# EAGLE schematic GasSensor (EAGLE 7.3.0)
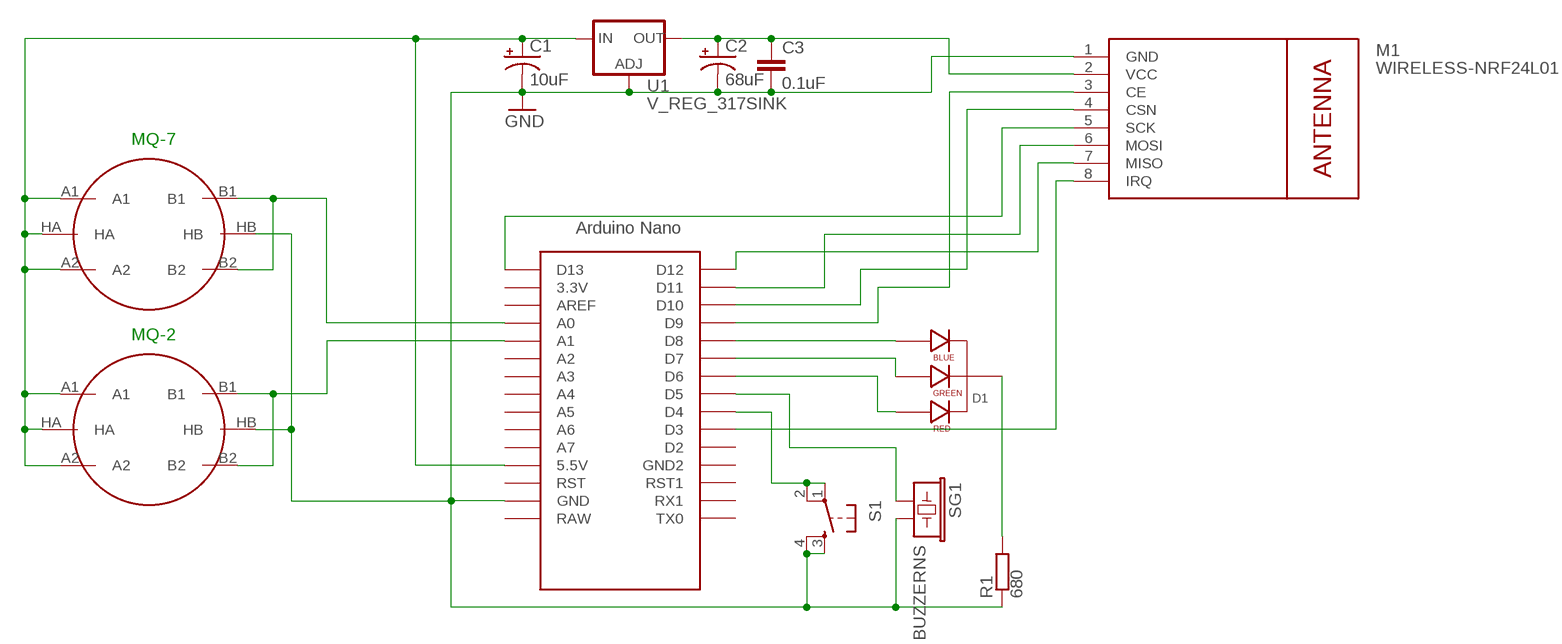
[diagram p0: schematic, sheet 1]

## Parts
C1  10uF  CAP_POL1206  [EIA3216]
C2  68uF  CAP_POL1206  [EIA3216]
C3  0.1uF  CAPEZ  [CAP-PTH-SMALLEZ]
D1  LED-RGB-CC-THRUCLEAR  [LED-RGB-THRU]
M1  WIRELESS-NRF24L01  [WIRELESS-NRF24L01]
R1  680  SMK  [SMK]
S1  TAC_SWITCHPTH  [TACTILE-PTH]
SG1  BUZZERNS  [BUZZER-12MM-NS]
U1  V_REG_317SINK  [TO220-ADJ]
U$1  NANO  [NANO]
U$2  CO2_SENSOR  METHANE_SENSOR  [MQ-3]
U$3  METHANE_SENSOR  [MQ-3]

## Nets
GND: C1.C(-) C2.C(-) C3.2 M1.1(GND) R1.2 S1.3 S1.4 SG1.- U1.ADJ U$1.GND U$2.HB U$3.HB
N$1: C1.A(+) U1.IN U$1.5V(5.5V) U$2.A1 U$2.A2 U$2.HA U$3.A1 U$3.A2 U$3.HA
N$2: D1.2(CATHODE) R1.1
N$3: U$1.A1 U$3.B1 U$3.B2
N$4: D1.4(BLUE_CATHODE) U$1.D8
N$5: C2.A(+) C3.1 M1.2(VCC) U1.OUT
N$6: M1.3(CE) U$1.D9
N$7: M1.4(CSN) U$1.D10
N$8: M1.7(MISO) U$1.D12
N$9: M1.6(MOSI) U$1.D11
N$10: M1.5(SCK) U$1.D13
N$11: D1.3(GREEN_CATHODE) U$1.D7
N$12: U$1.A0 U$2.B1 U$2.B2
N$13: M1.8(IRQ) U$1.D3
N$14: D1.1(RED_CATHODE) U$1.D6
N$15: SG1.+ U$1.D5
N$16: S1.1 S1.2 U$1.D4
Unconnected: U$1.3.3V U$1.A2 U$1.A3 U$1.A4 U$1.A5 U$1.A6 U$1.A7 U$1.AREF U$1.D2 U$1.GND1(GND2) U$1.ICSP1 U$1.ICSP2 U$1.ICSP3 U$1.ICSP4 U$1.ICSP5 U$1.ICSP6 U$1.RAW U$1.RST U$1.RST1 U$1.RX1 U$1.TX0

## Notes on the sheet
- MQ-7
- MQ-2

## Library data of the parts
C1 C2 = SparkFun-Passives:CAP_POL: Capacitor Polarized These are standard SMD and PTH capacitors. Normally 10uF, 47uF, and 100uF in electrolytic and tantalum varieties. Always verify the external diameter of the through hole cap, it varies with capacity, voltage, and manufacturer. The EIA devices should be standard.
C3 = SparkFun-Passives:CAP: Capacitor Standard 0603 ceramic capacitor, and 0.1" leaded capacitor.
D1 = SparkFun-LED:LED-RGB-CC-THRU: RGB Through-hole common cathode LED SparkFun Storefront: COM-00105 (Clear) COM-09264 (Diffuse); PROD_ID: DIO-08418
M1 = diy-modules:WIRELESS-NRF24L01: 2.4 GHz Wireless Module based on NRF24L01 chip
R1 = resistor-shunt:SMK: SMD SHUNT RESISTOR; OC_FARNELL: unknown; OC_NEWARK: unknown
S1 = SparkFun-Retired:TAC_SWITCH: Momentary Switch Button commonly used for reset or general input. Spark Fun Electronics SKU : COM-00097 SMT- SWCH-08247
SG1 = SparkFun-Electromechanical:BUZZER: Buzzer 12mm Spark Fun Electronics SKU : Comp-Buzzer
U1 = SparkFun-PowerIC:V_REG_317: Voltage Regulator Standard LM317 adjustable voltage regulator. AOI (Adjust Output Input). Google 'LM317 Calculator' for easy to use app to get the two resistor values needed. 240/720 for 5V output. 240/390 for 3.3V output. Spark Fun Electronics SKU : COM-00527
U$1 = Arduino-clone:NANO: Arduino Nano
U$2 U$3 = SparkFun-Sensors:METHANE_SENSOR: MQ-4 Methane Gas Sensor SEN-09404